# Altium project rookieboard.PrjPcb (part 2 of 2)

## Sheet usb_to_uart_swd_bridge.SchDoc: Bridge, USB to UART, SWD
size B; Organization: Altium Limited; Address1: L3, 12a Rodborough Rd; Address2: Frenchs Forest; Address3: NSW; Address4: Australia 2086; Revision: A; SheetNumber: 6; SheetTotal: 7
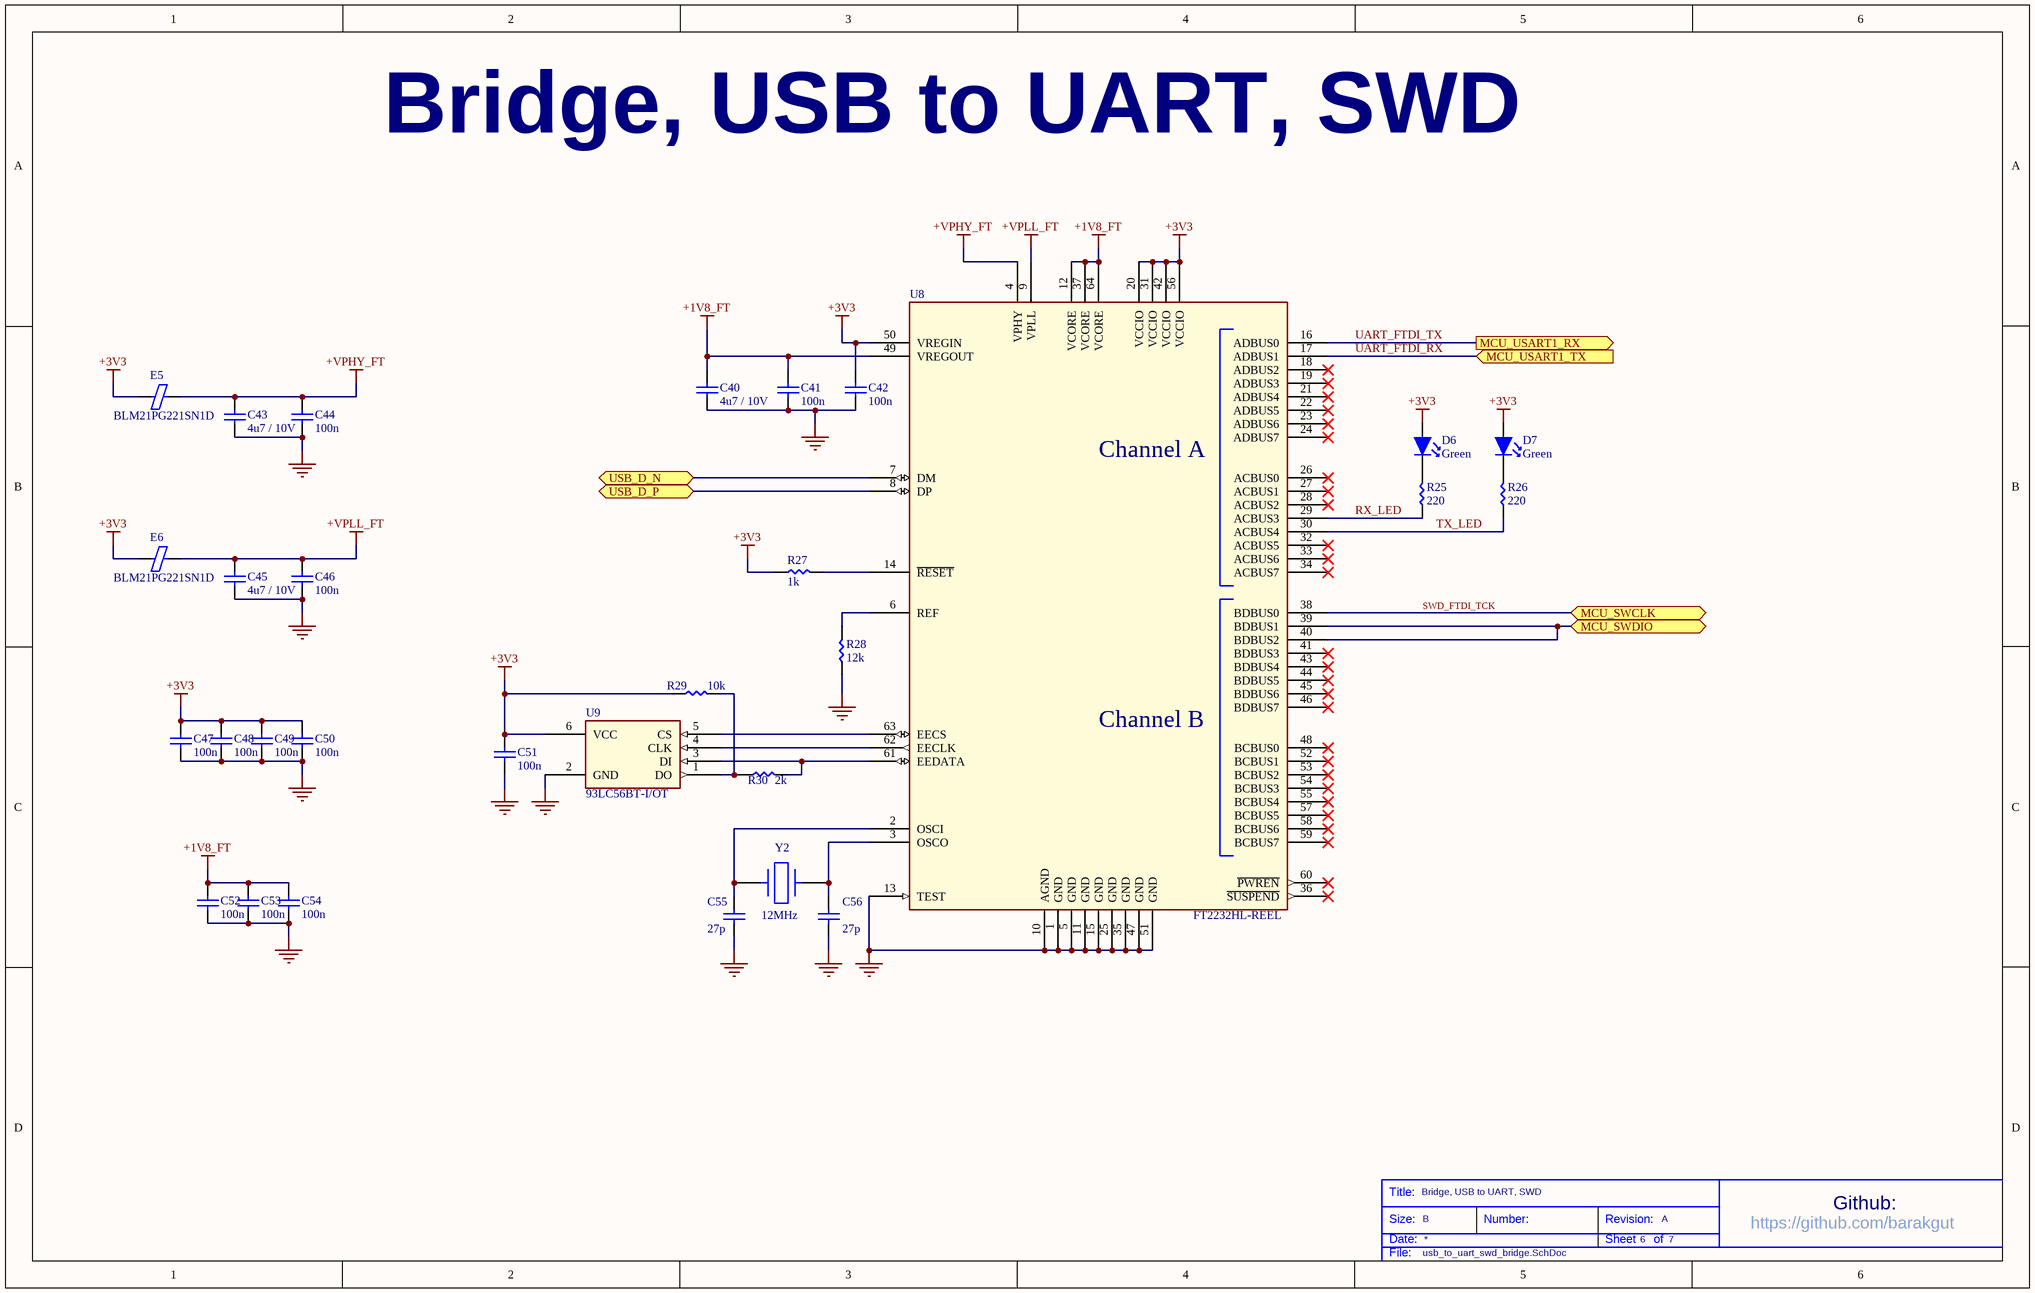
[diagram p5: usb_to_uart_swd_bridge.SchDoc]

### Parts
C40  4u7 / 10V  [C0805]
C41  100n  [C0402]
C42  100n  [C0402]
C43  4u7 / 10V  [C0805]
C44  100n  [C0402]
C45  4u7 / 10V  [C0805]
C46  100n  [C0402]
C47  100n  [C0402]
C48  100n  [C0402]
C49  100n  [C0402]
C50  100n  [C0402]
C51  100n  [C0402]
C52  100n  [C0402]
C53  100n  [C0402]
C54  100n  [C0402]
C55  27p  [C0402]
C56  27p  [C0402]
D6  Green  [150141VS73100_LED]
D7  Green  [150141VS73100_LED]
E5  BLM21PG221SN1D  [R0805]
E6  BLM21PG221SN1D  [R0805]
R25  220  [R0805]
R26  220  [R0805]
R27  1k  [R0805]
R28  12k  [R0805]
R29  10k  [R0805]
R30  2k  [R0805]
U8  FT2232HL-REEL  [LQFP64]
U9  93LC56BT-I/OT  [SOT-23-6]
Y2  12MHz  [ABLS7M2-12.000MHZ-D-2Y-T]

### Ports
MCU_SWCLK (bidir), MCU_SWDIO (bidir), MCU_USART1_RX (out), MCU_USART1_TX (in), USB_D_N (bidir), USB_D_P (bidir)

### Nets
+1V8_FT: C40.2 C41.2 C52.2 C53.2 C54.2 U8.12(VCORE) U8.37(VCORE) U8.49(VREGOUT) U8.64(VCORE)
+3V3: C42.2 C47.2 C48.2 C49.2 C50.2 C51.2 D6.2(A) D7.2(A) E5.1 E6.1 R27.1 R29.1 U8.20(VCCIO) U8.31(VCCIO) U8.42(VCCIO) U8.50(VREGIN) U8.56(VCCIO) U9.6(VCC)
+VPHY_FT: C43.2 C44.2 E5.2 U8.4(VPHY)
+VPLL_FT: C45.2 C46.2 E6.2 U8.9(VPLL)
GND: C40.1 C41.1 C42.1 C43.1 C44.1 C45.1 C46.1 C47.1 C48.1 C49.1 C50.1 C51.1 C52.1 C53.1 C54.1 C55.1 C56.1 R28.1 U8.1(GND) U8.5(GND) U8.10(AGND) U8.11(GND) U8.13(TEST) U8.15(GND) U8.25(GND) U8.35(GND) U8.47(GND) U8.51(GND) U9.2(GND)
RX_LED: R25.1 U8.29(ACBUS3)
SWD_FTDI_TCK: U8.38(BDBUS0) ; port MCU_SWCLK
TX_LED: R26.1 U8.30(ACBUS4)
UART_FTDI_RX: U8.17(ADBUS1) ; port MCU_USART1_TX
UART_FTDI_TX: U8.16(ADBUS0) ; port MCU_USART1_RX
NetC55_2: C55.2 U8.2(OSCI) Y2.2
NetC56_2: C56.2 U8.3(OSCO) Y2.1
NetD6_1: D6.1(K) R25.2
NetD7_1: D7.1(K) R26.2
NetR20_2: U8.7(DM) ; port USB_D_N
NetR21_2: U8.8(DP) ; port USB_D_P
NetR27_2: R27.2 U8.14(~{RESET})
NetR28_2: R28.2 U8.6(REF)
NetR29_2: R29.2 R30.1 U9.1(DO)
NetR30_2: R30.2 U8.61(EEDATA) U9.3(DI)
NetU1_34: U8.39(BDBUS1) U8.40(BDBUS2) ; port MCU_SWDIO
NetU8_62: U8.62(EECLK) U9.4(CLK)
NetU8_63: U8.63(EECS) U9.5(CS)

Not connected (* = marked no-connect by the designer): U8 18(ADBUS2)* 19(ADBUS3)* 21(ADBUS4)* 22(ADBUS5)* 23(ADBUS6)* 24(ADBUS7)* 26(ACBUS0)* 27(ACBUS1)* 28(ACBUS2)* 32(ACBUS5)* 33(ACBUS6)* 34(ACBUS7)* 36(~{SUSPEND})* 41(BDBUS3)* 43(BDBUS4)* 44(BDBUS5)* 45(BDBUS6)* 46(BDBUS7)* 48(BCBUS0)* 52(BCBUS1)* 53(BCBUS2)* 54(BCBUS3)* 55(BCBUS4)* 57(BCBUS5)* 58(BCBUS6)* 59(BCBUS7)* 60(~{PWREN})*

### Notes on the sheet
- Bridge, USB to UART, SWD
- Title:
- Size:
- Date:
- B
- Number:
- Revision:
- Sheet
- of
- https://github.com/barakgut
- Github:
- File:
- (in symbol FT2232HL-REEL) Channel A; Channel B

### Library data of the parts
C40 C43 C45 = C2012X7R1A475K085AC: 4.7µF ±10% 10V X7R Ceramic Capacitor -55°C ~ 125°C Surface Mount, MLCC 0805 (2012 Metric) 0.079" L x 0.049" W (2.00mm x 1.25mm); Manufacturer: TDK; Product Training Modules: C Series General Applications SEAT, CCV, and TVCL Design Tools Guide to Replacing an Electrolytic Capacitor with an MLCC; EDA / CAD Models: Download from Accelerated Designs; Online Catalog: C Series, General Purpose; Other Names: 445-14527-6; Supplier 1: Digi-Key; Supplier Part Number 1: 445-14527-1-ND; Stock 1: 1; Pricing 1: 1=0.28, 10=0.19, 100=0.1075, 500=0.0759, 1000=0.0664 (USD); RoHS Information: RoHS Certificate-MLCC; Standard Package: 1; Category: Capacitors; Family: Ceramic Capacitors; Series: C; Packaging: Digi-Reel®; Capacitance: 4.7µF; Tolerance: ±10%; Voltage - Rated: 10V; Temperature Coefficient: X7R; Mounting Type: Surface Mount, MLCC; Operating Temperature: -55°C ~ 125°C; Applications: General Purpose; Package / Case: 0805 (2012 Metric); Size / Dimension: 0.079" L x 0.049" W (2.00mm x 1.25mm); Thickness (Max): 0.039" (1.00mm); Manufacturer Part Number: C2012X7R1A475K085AC
C41 C42 C44 C46-C54 = CGA2B3X7R1E104K050BB: TDK         CGA2B3X7R1E104K050BB             SMD Multilayer Ceramic Capacitor, 0402 [1005 Metric], 0.1 F, 25 V,  10%, X7R, CGA Series; PCN Part Number: MLCC Part Number Change 30/Nov/2012; Capacitance: 0.1µF; Product Training Modules: CGA Series for Automotive Applications SEAT, CCV, and TVCL Design Tools Guide to Replacing an Electrolytic Capacitor with an MLCC; Featured Product: CGA Series MLCC Capacitors; Voltage - Rated: 25V; Online Catalog: CGA Series, Automotive General, Mid and High Voltage; Other Names: 445-6902-6; Supplier 1: Digi-Key; Supplier Part Number 1: 445-6902-1-ND; Manufacturer: TDK; Stock 1: 100000; Pricing 1: 1=0.16, 10=0.115, 100=0.054, 500=0.0379, 1000=0.0314, 2500=0.0292, 5000=0.0267 (USD); Package / Case: 0402 (1005 Metric); Packaging: Digi-Reel®; RoHS Information: RoHS Certificate-MLCC; Standard Package: 1; Category: Capacitors; Family: Ceramic Capacitors; Series: CGA; Tolerance: ±10%; Temperature Coefficient: X7R; Mounting Type: Surface Mount, MLCC; Operating Temperature: -55°C ~ 125°C; Applications: Automotive; Ratings: AEC-Q200; Size / Dimension: 0.039" L x 0.020" W (1.00mm x 0.50mm); Height - Seated (Max): -; Thickness (Max): 0.022" (0.55mm); Lead Spacing: -; Features: -; Lead Style: -; ComponentLink1URL: http://www.farnell.com/datasheets/1735392.pdf; ComponentLink1Description: http://www.farnell.com/datasheets/1735392.pdf; ComponentLink2URL: http://www.mouser.com/ds/2/400/lcc_automotive_general_en-843974.pdf; ComponentLink2Description: http://www.mouser.com/ds/2/400/lcc_automotive_general_en-843974.pdf; Manufacturer Part Number: CGA2B3X7R1E104K050BB
C55 C56 = GJM1555C1H270FB01D: Manufacturer: Murata; Supplier 1: Digi-Key; Supplier Part Number 1: 490-16380-1-ND; Stock 1: 14501; Pricing 1: 1=0.23, 10=0.155, 100=0.0784, 500=0.0536, 1000=0.0474, 2500=0.0454, 5000=0.0413 (USD); Manufacturer Part Number: GJM1555C1H270FB01D; ComponentLink1URL: http://datasheet.octopart.com/GJM1555C1H270FB01D-Murata-datasheet-8819587.pdf; ComponentLink1Description: http://datasheet.octopart.com/GJM1555C1H270FB01D-Murata-datasheet-8819587.pdf; ComponentLink2URL: http://datasheet.octopart.com/GJM1555C1H270FB01D-Murata-datasheet-10025737.pdf; ComponentLink2Description: http://datasheet.octopart.com/GJM1555C1H270FB01D-Murata-datasheet-10025737.pdf; ComponentLink3URL: http://datasheet.octopart.com/GJM1555C1H270FB01D-Murata-datasheet-11978611.pdf; ComponentLink3Description: http://datasheet.octopart.com/GJM1555C1H270FB01D-Murata-datasheet-11978611.pdf; ComponentLink4URL: http://datasheet.octopart.com/GJM1555C1H270FB01D-Murata-datasheet-12510076.pdf; ComponentLink4Description: http://datasheet.octopart.com/GJM1555C1H270FB01D-Murata-datasheet-12510076.pdf; ComponentLink5URL: http://datasheet.octopart.com/GJM1555C1H270FB01D-Murata-datasheet-12515295.pdf; ComponentLink5Description: http://datasheet.octopart.com/GJM1555C1H270FB01D-Murata-datasheet-12515295.pdf
D6 D7 = 150141VS73100: WURTH ELEKTRONIK   150141VS73100   LED, GREEN, 90MCD, 570NM; Manufacturer: Wurth Electronics; Dynamic Catalog: 3.5mm x 2.8mm Round with Flat Top LEDs; 3D Model: SMTW_3528.igs / SMTW_3528.stp / SMTW_3528.wrl; Wavelength - Peak: 572nm; Voltage - Forward (Vf) (Typ): 2V; Current - Test: 20mA; Viewing Angle: 120°; Lens Type: Clear; Lens Style/Size: Round with Flat Top, 2.4mm; Other Names: 732-5002-1; Supplier 1: Digi-Key; Supplier Part Number 1: 732-5002-1-ND; Stock 1: 7722; Pricing 1: 1=0.17, 100=0.149, 500=0.113 (USD); Standard Package: 1; Category: Optoelectronics; Family: LED Indication - Discrete; Series: WL-SMTW; Packaging: Cut Tape (CT); Color: Green; Wavelength - Dominant: 570nm; Millicandela Rating: 90mcd; Package / Case: 2-PLCC; Size / Dimension: 3.20mm L x 2.80mm W; Height: 2.10mm; Mounting Type: Surface Mount; Online Catalog: 3.5mm x 2.8mm Round with Flat Top LEDs; Manufacturer Part Number: 150141VS73100
E5 E6 = BLM21PG221SN1D: FERRITE CHIP 220 OHM 0805; Manufacturer: Murata; Product Training Modules: Ferrite Beads and Arrays; Catalog Drawings: BLM21 Series Side BLM21 Series Top; EDA / CAD Models: Download from Accelerated Designs; Filter Type: Power Line; Number of Lines: 1; Impedance @ Frequency: 220 Ohm @ 100MHz; Current Rating (Max): 2A; DC Resistance (DCR) (Max): 45 mOhm; Online Catalog: EMIFIL® BLM21P Series; Other Names: 490-1054-6; Supplier 1: Digi-Key; Supplier Part Number 1: 490-1054-1-ND; Stock 1: 1796179; Pricing 1: 1=0.1, 10=0.081, 25=0.0732, 50=0.0538, 100=0.0464, 250=0.0366, 500=0.0309, 1000=0.0261 (USD); Standard Package: 1; Category: Filters; Family: Ferrite Beads and Chips; Series: BLM21P; Packaging: Digi-Reel®; Ratings: -; Operating Temperature: -55°C ~ 125°C; Package / Case: 0805 (2012 Metric); Mounting Type: Surface Mount; Height (Max): 0.041" (1.05mm); Size / Dimension: 0.079" L x 0.049" W (2.00mm x 1.25mm); Manufacturer Part Number: BLM21PG221SN1D
R25 R26 = AC0805FR-07220RL: Thick Film Resistors - SMD 1/8W 220ohm 1%; Manufacturer: Yageo; Case Height: 0.5 mm; Case Length: 2 mm; Case Width: 1.25 mm; Power Rating: 125 mW (1/8 W); Resistance: 220 Ohms; Temperature Coefficient: 100 PPM / C; Voltage Rating: 150 V; Supplier 1: Digi-Key; Supplier Part Number 1: YAG3711CT-ND; Stock 1: 11948; Pricing 1: 1=0.1, 10=0.055, 100=0.0225, 1000=0.0101, 2500=0.0088 (USD); Brand: Yageo; Case Code - in: 0805; Case Code - mm: 2012; Dimensions: 1.25 mm W x 2 mm L x 0.5 mm H; Product Category: Thick Film Resistors - SMD; Operating Temperature Range: - 55 C to + 155 C; Package / Case: 0805 (2012 metric); Packaging: Reel; Product: Thick Film Resistors SMD; Termination Style: SMD/SMT; RoHS: Details; Tolerance: 1 %; Series: AC; Type: Chip Resistor Surface Mount; Manufacturer Part Number: AC0805FR-07220RL
R27 = RC0805FR-071KL: RES SMD 1K OHM 1% 1/8W 0805; Manufacturer: Yageo; Resistance: 1 kOhms; Power Rating: 125 mW (1/8 W); Voltage Rating: 150 V; Temperature Coefficient: 100 PPM / C; Supplier 1: Digi-Key; Supplier Part Number 1: 311-1.00KCRCT-ND; Stock 1: 1262363; Pricing 1: 1=0.1, 10=0.046, 100=0.0186, 1000=0.0084, 2500=0.0073 (USD); Termination Style: SMD/SMT; Product: Thick Film Resistors General Purpose; Tolerance: 1 %; Case Code - in: 0805; Case Code - mm: 2012; Series: RC; Operating Temperature Range: - 55 C to + 155 C; Packaging: Reel; Manufacturer Part Number: RC0805FR-071KL
R28 = AC0805FR-0712KL: Res Thick Film 0805 12K Ohm 1% 0.125W(1/8W) ±100ppm/C Sulfur Resistant Molded SMD Automotive Paper T/R; Manufacturer: Yageo; Resistance: 12kohm; Temperature Coefficient: ±100; Product Length (mm): 2mm; Product Depth (mm): 1.25mm; Product Height (mm): 0.5mm; Supplier 1: Digi-Key; Supplier Part Number 1: YAG3692CT-ND; Stock 1: 218; Pricing 1: 1=0.1, 10=0.055, 100=0.0225, 1000=0.0101, 2500=0.0088 (USD); Type: Thick Film; Power Rating(s): 1/8W; Tolerance (+ or -): 1%; Package / Case: 0805; Packaging: Tape and Reel; Operating Temp Range: -55C to 155C; Case Style: Molded; Military Standard: Not Required; Failure Rate: Not Required; Construction: Rectangular; Termination Style: Not Required; Manufacturer Part Number: AC0805FR-0712KL
R29 = RC0805FR-0710KL: RES SMD 10K OHM 1% 1/8W 0805; Manufacturer: Yageo; Resistance: 10 kOhms; Power Rating: 125 mW (1/8 W); Voltage Rating: 150 V; Temperature Coefficient: 100 PPM / C; Supplier 1: Digi-Key; Supplier Part Number 1: 311-10.0KCRCT-ND; Stock 1: 31531286; Pricing 1: 1=0.1, 10=0.046, 100=0.0186, 1000=0.0084, 2500=0.0073 (USD); Termination Style: SMD/SMT; Product: Thick Film Resistors General Purpose; Tolerance: 1 %; Case Code - in: 0805; Case Code - mm: 2012; Series: RC; Operating Temperature Range: - 55 C to + 155 C; Packaging: Reel; Manufacturer Part Number: RC0805FR-0710KL
R30 = RC0805FR-072KL: RES SMD 2K OHM 1% 1/8W 0805; Manufacturer: Yageo; Resistance: 2 kOhms; Power Rating: 125 mW (1/8 W); Voltage Rating: 150 V; Temperature Coefficient: 100 PPM / C; Supplier 1: Digi-Key; Supplier Part Number 1: 311-2.00KCRCT-ND; Stock 1: 993055; Pricing 1: 1=0.1, 10=0.046, 100=0.0186, 1000=0.0084, 2500=0.0073 (USD); Termination Style: SMD/SMT; Product: Thick Film Resistors General Purpose; Tolerance: 1 %; Case Code - in: 0805; Case Code - mm: 2012; Series: RC; Operating Temperature Range: - 55 C to + 155 C; Packaging: Reel; Manufacturer Part Number: RC0805FR-072KL
U8 = FT2232HL-REEL: IC USB HS DUAL UART/FIFO 64-LQFP; Manufacturer: FTDI; Number of Channels: 2; Interface Circuit Standard 1: RS-232/RS-422/RS-485; Transmitter and Receiver FIFO Counter: No; Data Rate: 480Mbps; Operating Supply Voltage (Typ): 1.8/3.3V; Operating Supply Voltage (Max): 3.63V; Operating Supply Voltage (Min): 1.62V; Supply Current: 70(Typ)mA; Supplier 1: Digi-Key; Supplier Part Number 1: 768-1024-1-ND; Stock 1: 30383; Pricing 1: 1=6.71, 10=6.2, 100=5.4, 250=4.56, 500=4.06 (USD); Package Type: LQFP; Packaging: Tape and Reel; Mounting: Surface Mount; Pin Count: 64; Operating Temperature (Min): -40C; Operating Temperature (Max): 85C; Operating Temperature Classification: Industrial; Manufacturer Part Number: FT2232HL-REEL
U9 = 93LC56BT-I/OT: EEPROM 128x16; Manufacturer: Microchip; Access Time (Max): 250 ns; Data Retention: 200; Density: 2048 Bit; Frequency: 2 MHz; Interface Type: Serial (Microwire); Operating Supply Voltage (Max): 5.5 V; Operating Supply Voltage (Min): 2.5 V; Operating Supply Voltage (Typ): 3.3/5 V; Programmable: Yes; Rad Hardened: No; Supply Current: 2 mA; Supplier 1: Digi-Key; Supplier Part Number 1: 93LC56BT-I/OTCT-ND; Stock 1: 24330; Pricing 1: 1=0.23, 25=0.2164, 100=0.2119 (USD); Mounting: Surface Mount; Operating Temp Range: -40C to 85C; Operating Temperature (Max): 85C; Operating Temperature (Min): -40C; Operating Temperature Classification: Industrial; Organization: 128x16; Package Type: SOT-23; Packaging: Tape and Reel; Pin Count: 6; Write Protection: No; Manufacturer Part Number: 93LC56BT-I/OT
Y2 = ABLS7M2-12.000MHZ-D-2Y-T: Crystals 12.0MHz 18pF 30ppm -40C +85C; Manufacturer: Abracon; Frequency Tolerance: ±20ppm; ESR (Equivalent Series Resistance): 60 Ohm; Operating Mode: Fundamental; Supplier 1: Digi-Key; Supplier Part Number 1: 535-12824-1-ND; Stock 1: 6192; Pricing 1: 1=0.4, 10=0.33, 50=0.297, 100=0.264, 500=0.2508, 1000=0.2112 (USD); Category: Crystals and Oscillators; Family: Crystals; Series: ABLS7M2; Packaging: Tape & Reel (TR); Type: MHz Crystal; Frequency: 12MHz; Frequency Stability: ±30ppm; Load Capacitance: 18pF; Operating Temperature: -40°C ~ 85°C; Ratings: -; Mounting Type: Surface Mount; Package / Case: 2-SMD, Flat Lead; Size / Dimension: 0.276" L x 0.161" W (7.00mm x 4.10mm); Height: 0.079" (2.00mm); Manufacturer Part Number: ABLS7M2-12.000MHZ-D-2Y-T

## Sheet power.SchDoc: Power
size A4; Organization: Altium Limited; Address1: L3, 12a Rodborough Rd; Address2: Frenchs Forest; Address3: NSW; Address4: Australia 2086; Revision: A; SheetNumber: 7; SheetTotal: 7
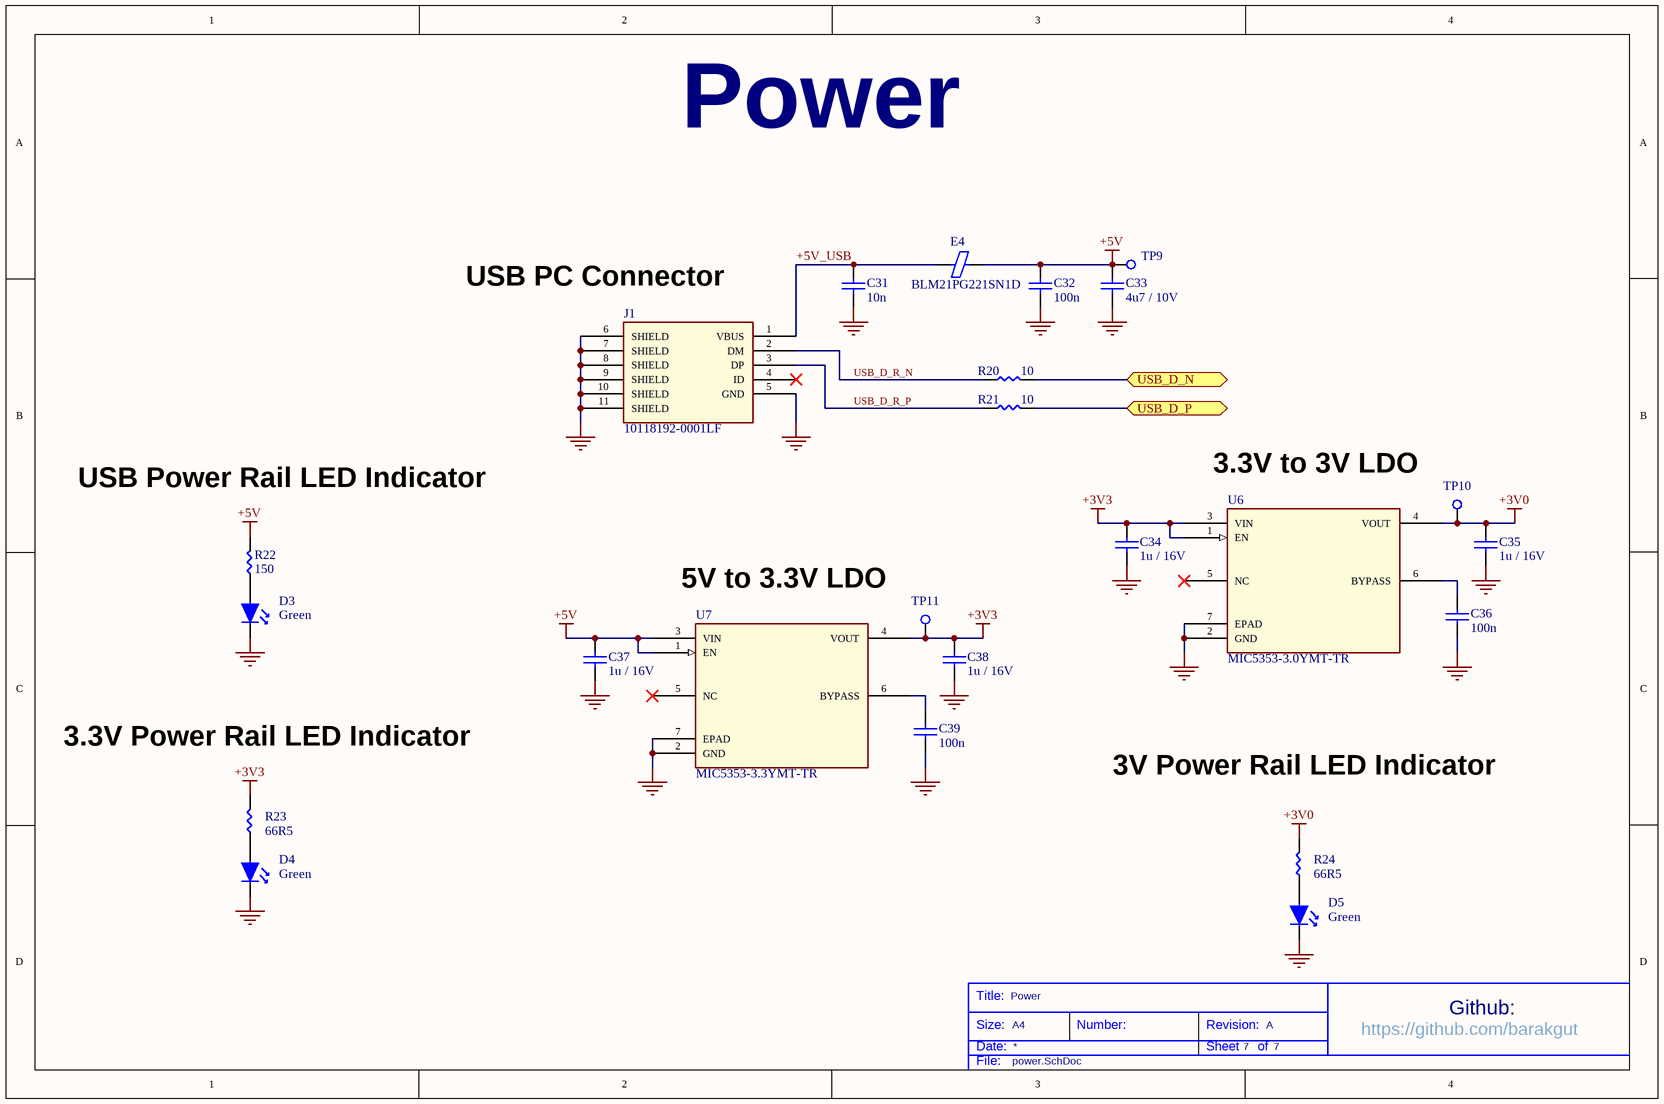
[diagram p6: power.SchDoc]

### Parts
C31  10n  [C0402]
C32  100n  [C0402]
C33  4u7 / 10V  [C0805]
C34  1u / 16V  [C0805]
C35  1u / 16V  [C0805]
C36  100n  [C0402]
C37  1u / 16V  [C0805]
C38  1u / 16V  [C0805]
C39  100n  [C0402]
D3  Green  [150141VS73100_LED]
D4  Green  [150141VS73100_LED]
D5  Green  [150141VS73100_LED]
E4  BLM21PG221SN1D  [R0805]
J1  10118192-0001LF  [10118192-0001LF]
R20  10  [R0402]
R21  10  [R0402]
R22  150  [R0805]
R23  66R5  [R0805]
R24  66R5  [R0805]
TP9  Test Pad 1mm  [TP_1MM]  (value not drawn)  (no BOM)
TP10  Test Pad 1mm  [TP_1MM]  (value not drawn)  (no BOM)
TP11  Test Pad 1mm  [TP_1MM]  (value not drawn)  (no BOM)
U6  MIC5353-3.0YMT-TR  [6-MLF]
U7  MIC5353-3.3YMT-TR  [6-MLF]

### Ports
USB_D_N (bidir), USB_D_P (bidir)

### Nets
+3V0: C35.2 R24.2 TP10.1 U6.4(VOUT)
+3V3: C34.2 C38.2 R23.2 TP11.1 U6.1(EN) U6.3(VIN) U7.4(VOUT)
+5V: C32.2 C33.2 C37.2 E4.2 R22.2 TP9.1 U7.1(EN) U7.3(VIN)
GND: C31.1 C32.1 C33.1 C34.1 C35.1 C36.1 C37.1 C38.1 C39.1 D3.1(K) D4.1(K) D5.1(K) J1.5(GND) J1.6(SHIELD) J1.7(SHIELD) J1.8(SHIELD) J1.9(SHIELD) J1.10(SHIELD) J1.11(SHIELD) U6.2(GND) U6.7(EPAD) U7.2(GND) U7.7(EPAD)
+5V_USB: C31.2 E4.1 J1.1(VBUS)
USB_D_R_N: J1.2(DM) R20.1
USB_D_R_P: J1.3(DP) R21.1
NetC36_2: C36.2 U6.6(BYPASS)
NetC39_2: C39.2 U7.6(BYPASS)
NetD3_2: D3.2(A) R22.1
NetD4_2: D4.2(A) R23.1
NetD5_2: D5.2(A) R24.1
NetR20_2: R20.2 ; port USB_D_N
NetR21_2: R21.2 ; port USB_D_P

Not connected (* = marked no-connect by the designer): J1 4(ID)*; U6 5(NC)*; U7 5(NC)*

### Notes on the sheet
- Power
- (near J1) USB PC Connector
- 3.3V to 3V LDO
- (near R22) USB Power Rail LED Indicator
- 5V to 3.3V LDO
- (near R23) 3.3V Power Rail LED Indicator
- 3V Power Rail LED Indicator
- Title:
- Size:
- Date:
- A4
- Number:
- Revision:
- Sheet
- of
- https://github.com/barakgut
- Github:
- File:

### Library data of the parts
C31 = CGA2B3X7R1V103K050BB: TDK         CGA2B3X7R1V103K050BB             SMD Multilayer Ceramic Capacitor, 0402 [1005 Metric], 0.01 F, 35 V,  10%, X7R, CGA Series; PCN Part Number: MLCC Part Number Change 30/Nov/2012; Product Training Modules: CGA Series for Automotive Applications SEAT, CCV, and TVCL Design Tools Guide to Replacing an Electrolytic Capacitor with an MLCC; Featured Product: CGA Series MLCC Capacitors; Capacitance: 10000pF; Voltage - Rated: 35V; Online Catalog: CGA Series, Automotive General, Mid and High Voltage; Other Names: 445-6900-6; Supplier 1: Digi-Key; Supplier Part Number 1: 445-6900-1-ND; Manufacturer: TDK; Stock 1: 100000; Pricing 1: 1=0.11, 10=0.083, 100=0.0372, 500=0.0265, 1000=0.0209, 2500=0.019, 5000=0.0174 (USD); Tolerance: ±10%; Operating Temperature: -55°C ~ 125°C; Category: Capacitors; RoHS Information: RoHS Certificate-MLCC; Standard Package: 1; Family: Ceramic Capacitors; Series: CGA; Packaging: Digi-Reel®; Temperature Coefficient: X7R; Mounting Type: Surface Mount, MLCC; Applications: Automotive; Ratings: AEC-Q200; Package / Case: 0402 (1005 Metric); Size / Dimension: 0.039" L x 0.020" W (1.00mm x 0.50mm); Height - Seated (Max): -; Thickness (Max): 0.022" (0.55mm); Lead Spacing: -; Features: -; Lead Style: -; ComponentLink1URL: http://www.farnell.com/datasheets/1807242.pdf; ComponentLink1Description: http://www.farnell.com/datasheets/1807242.pdf; ComponentLink2URL: http://www.mouser.com/ds/2/400/lcc_automotive_general_en-843974.pdf; ComponentLink2Description: http://www.mouser.com/ds/2/400/lcc_automotive_general_en-843974.pdf; Manufacturer Part Number: CGA2B3X7R1V103K050BB
C32 C36 C39 = CGA2B3X7R1E104K050BB: as C41 on sheet usb_to_uart_swd_bridge; Supplier 1: Digi-Key; Supplier Part Number 1: 445-6902-1-ND; Manufacturer: TDK; Stock 1: 100000; Pricing 1: 1=0.16, 10=0.115, 100=0.054, 500=0.0379, 1000=0.0314, 2500=0.0292, 5000=0.0267 (USD); Package / Case: 0402 (1005 Metric); Packaging: Digi-Reel®; RoHS Information: RoHS Certificate-MLCC; Standard Package: 1; Category: Capacitors; Family: Ceramic Capacitors; Series: CGA; Tolerance: ±10%; Temperature Coefficient: X7R; Mounting Type: Surface Mount, MLCC; Operating Temperature: -55°C ~ 125°C; Applications: Automotive; Ratings: AEC-Q200; Size / Dimension: 0.039" L x 0.020" W (1.00mm x 0.50mm); Height - Seated (Max): -; Thickness (Max): 0.022" (0.55mm); Lead Spacing: -; Features: -; Lead Style: -; ComponentLink1URL: http://www.farnell.com/datasheets/1735392.pdf; ComponentLink1Description: http://www.farnell.com/datasheets/1735392.pdf; ComponentLink2URL: http://www.mouser.com/ds/2/400/lcc_automotive_general_en-843974.pdf; ComponentLink2Description: http://www.mouser.com/ds/2/400/lcc_automotive_general_en-843974.pdf; Manufacturer Part Number: CGA2B3X7R1E104K050BB
C33 = C2012X7R1A475K085AC: as C40 on sheet usb_to_uart_swd_bridge; Supplier 1: Digi-Key; Supplier Part Number 1: 445-14527-1-ND; Stock 1: 1; Pricing 1: 1=0.28, 10=0.19, 100=0.1075, 500=0.0759, 1000=0.0664 (USD); RoHS Information: RoHS Certificate-MLCC; Standard Package: 1; Category: Capacitors; Family: Ceramic Capacitors; Series: C; Packaging: Digi-Reel®; Capacitance: 4.7µF; Tolerance: ±10%; Voltage - Rated: 10V; Temperature Coefficient: X7R; Mounting Type: Surface Mount, MLCC; Operating Temperature: -55°C ~ 125°C; Applications: General Purpose; Package / Case: 0805 (2012 Metric); Size / Dimension: 0.079" L x 0.049" W (2.00mm x 1.25mm); Thickness (Max): 0.039" (1.00mm); Manufacturer Part Number: C2012X7R1A475K085AC
C34 C35 C37 C38 = C0805C105K4RAC7800: Multilayer Ceramic Capacitors MLCC - SMD/SMT 16volts 1uF X7R 10%; Manufacturer: KEMET; Rad Hard: No; Voltage: 16 Vdc; Product Length: 2 mm; Product Height: 0.9 mm; Product Depth: 1.25 mm; Supplier 1: Digi-Key; Supplier Part Number 1: 399-1284-1-ND; Stock 1: 40000; Pricing 1: 1=0.17, 10=0.124, 100=0.0581, 500=0.0408, 1000=0.0337 (USD); Package/Case: 0805; Mounting: Surface Mount; Capacitance Value: 1 uF; Tolerance: 10 %; Dielectric: X7R; Operating Temperature: -55 to 125 °C; Construction: Flat; Category: Capacitor Ceramic Multilayer; Manufacturer Part Number: C0805C105K4RAC7800
D3-D5 = 150141VS73100: as D6 on sheet usb_to_uart_swd_bridge; Supplier 1: Digi-Key; Supplier Part Number 1: 732-5002-1-ND; Stock 1: 7722; Pricing 1: 1=0.17, 100=0.149, 500=0.113 (USD); Standard Package: 1; Category: Optoelectronics; Family: LED Indication - Discrete; Series: WL-SMTW; Packaging: Cut Tape (CT); Color: Green; Wavelength - Dominant: 570nm; Millicandela Rating: 90mcd; Package / Case: 2-PLCC; Size / Dimension: 3.20mm L x 2.80mm W; Height: 2.10mm; Mounting Type: Surface Mount; Online Catalog: 3.5mm x 2.8mm Round with Flat Top LEDs; Manufacturer Part Number: 150141VS73100
E4 = BLM21PG221SN1D: as E5 on sheet usb_to_uart_swd_bridge; Supplier 1: Digi-Key; Supplier Part Number 1: 490-1054-1-ND; Stock 1: 1796179; Pricing 1: 1=0.1, 10=0.081, 25=0.0732, 50=0.0538, 100=0.0464, 250=0.0366, 500=0.0309, 1000=0.0261 (USD); Standard Package: 1; Category: Filters; Family: Ferrite Beads and Chips; Series: BLM21P; Packaging: Digi-Reel®; Ratings: -; Operating Temperature: -55°C ~ 125°C; Package / Case: 0805 (2012 Metric); Mounting Type: Surface Mount; Height (Max): 0.041" (1.05mm); Size / Dimension: 0.079" L x 0.049" W (2.00mm x 1.25mm); Manufacturer Part Number: BLM21PG221SN1D
J1 = 10118192-0001LF: USB - micro B USB 2.0 Receptacle Connector 5 Position Surface Mount, Right Angle, Horizontal; Manufacturer: Amphenol FCI; Number of Contacts: 5 Contact; Gender: Female; Current Rating: 1.8 A; Brand: FCI; Connector Type: Micro USB Type B receptacle; Insulation Resistance: 1000 MOhms; Supplier 1: Digi-Key; Supplier Part Number 1: 609-4613-1-ND; Stock 1: 158518; Pricing 1: 1=0.42, 10=0.393, 25=0.3536, 50=0.3144, 100=0.3013, 250=0.2751, 500=0.262 (USD); Product Category: USB Connectors; RoHS: Details; Product: Micro USB Type B Connectors; Standard: USB 2.0; Termination Style: SMD/SMT; Color: Black; Contact Material: Copper Alloy; Contact Plating: Gold; Flammability Rating: UL 94 V-0; Mounting Angle: Right; Operating Temperature Range: - 55 C to + 85 C; Packaging: Reel; Factory Pack Quantity: 1400; Manufacturer Part Number: 10118192-0001LF
R20 R21 = RC0402FR-0710RL: RES SMD 10 OHM 1% 1/16W 0402; Manufacturer: Yageo; Resistance: 10 Ohms; Power Rating: 62.5 mW (1/16 W); Temperature Coefficient: 100 PPM / C; Voltage Rating: 50 V; Supplier 1: Digi-Key; Supplier Part Number 1: 311-10.0LRCT-ND; Stock 1: 1306139; Pricing 1: 1=0.1, 10=0.027, 100=0.0111, 1000=0.005, 2500=0.0043, 5000=0.0036 (USD); Case Code - in: 0402; Case Code - mm: 1005; Operating Temperature Range: - 55 C to + 155 C; Packaging: Reel; Product: Thick Film Resistors General Purpose; Series: RC; Termination Style: SMD/SMT; Tolerance: 1 %; Manufacturer Part Number: RC0402FR-0710RL; ComponentLink1URL: http://www.farnell.com/datasheets/1018594.pdf; ComponentLink1Description: http://www.farnell.com/datasheets/1018594.pdf; ComponentLink2URL: https://www.verical.com/server-webapp/html/getDatasheet?partID=323697; ComponentLink2Description: https://www.verical.com/server-webapp/html/getDatasheet?partID=323697
R22 = AC0805FR-07150RL: Thick Film Resistors - SMD 1/8W 150ohm 1%; Manufacturer: Yageo; Case Height: 0.5 mm; Case Length: 2 mm; Case Width: 1.25 mm; Power Rating: 125 mW (1/8 W); Resistance: 150 Ohms; Temperature Coefficient: 100 PPM / C; Voltage Rating: 150 V; Supplier 1: Digi-Key; Supplier Part Number 1: YAG3694CT-ND; Stock 1: 32315; Pricing 1: 1=0.1, 10=0.055, 100=0.0225, 1000=0.0101, 2500=0.0088 (USD); Brand: Yageo; Case Code - in: 0805; Case Code - mm: 2012; Dimensions: 1.25 mm W x 2 mm L x 0.5 mm H; Product Category: Thick Film Resistors - SMD; Operating Temperature Range: - 55 C to + 155 C; Package / Case: 0805 (2012 metric); Packaging: Reel; Product: Thick Film Resistors SMD; Termination Style: SMD/SMT; RoHS: Details; Tolerance: 1 %; Series: AC; Type: Chip Resistor Surface Mount; Manufacturer Part Number: AC0805FR-07150RL
R23 R24 = RC0805FR-0766R5L: Thick Film Resistors - SMD 66.5 OHM 1%; Manufacturer: Yageo; Case Height: 0.5 mm; Case Length: 2 mm; Case Width: 1.25 mm; Power Rating: 125 mW (1/8 W); Resistance: 66.5 Ohms; Temperature Coefficient: 100 PPM / C; Voltage Rating: 150 V; Supplier 1: Digi-Key; Supplier Part Number 1: 311-66.5CRCT-ND; Stock 1: 162629; Pricing 1: 1=0.1, 10=0.056, 100=0.0228, 1000=0.0102, 2500=0.0089 (USD); Brand: Yageo; Case Code - in: 0805; Case Code - mm: 2012; Dimensions: 1.25 mm W x 2 mm L x 0.5 mm H; Product Category: Thick Film Resistors - SMD; Operating Temperature Range: - 55 C to + 155 C; Package / Case: 0805 (2012 metric); Packaging: Reel; Product: Thick Film Resistors General Purpose; Termination Style: SMD/SMT; RoHS: Details; Tolerance: 1 %; Series: RC; Type: General Purpose Chip Resistor Surface Mount; Manufacturer Part Number: RC0805FR-0766R5L
TP9-TP11 = TEST_PAD_1mm
U6 = MIC5353-3.0YMT-TR: 6Vin, Single 500mA ULDO, 6 UDFN 1.6x1.6x0.6mm T/R; Manufacturer: Microchip; Regulator Topology: Positive Fixed; Voltage - Output: 3V; Voltage - Dropout (Typical): 0.16V @ 500mA; Number of Regulators: 1; Voltage - Input: Up to 6V; Current - Limit (Min): 600mA; Supplier 1: Digi-Key; Supplier Part Number 1: 576-3679-1-ND; Stock 1: 4083; Pricing 1: 1=0.35, 25=0.2884, 100=0.2678 (USD); Category: Integrated Circuits (ICs); Family: PMIC - Voltage Regulators - Linear; Series: -; Packaging: Digi-Reel®; Current - Output: 500mA; Operating Temperature: -40°C ~ 125°C; Mounting Type: Surface Mount; Package / Case: 6-UFDFN Exposed Pad, 6-TMLF®; Supplier Device Package: 6-TMLF® (1.6x1.6); Manufacturer Part Number: MIC5353-3.0YMT-TR
U7 = MIC5353-3.3YMT-TR: MICROCHIP         MIC5353-3.3YMT-TR             Fixed LDO Voltage Regulator, 2.6V to 6V, 160mV Dropout, 3.3Vout, 500mAout, MLF-6; Fixed Output Voltage Nom.: 3.3V; Output Current: 500mA; LDO Regulator Case Style: MLF; No. of Pins: 6Pins; Product Range: 3.3V 500mA LDO Voltage Regulators; SVHC: No SVHC (17-Dec-2015); Supplier 1: Digi-Key; Supplier Part Number 1: 576-3680-1-ND; Manufacturer: Microchip; Stock 1: 12369; Pricing 1: 1=0.43, 25=0.35, 100=0.325 (USD); Output Type: Fixed; Input Voltage Min: 2.6V; Input Voltage Max: 6V; Adjustable Output Voltage Min: -; Adjustable Output Voltage Max: -; Dropout Voltage Vdo: 160mV; Operating Temperature Min: -40°C; Operating Temperature Max: 125°C; Packaging: Cut Tape; Automotive Qualification Standard: -; MSL: MSL 1 - Unlimited; Manufacturer Part Number: MIC5353-3.3YMT-TR

## Nets that join several sheets
+3V0: peripherals (8 pins), power (C35.2 R24.2 TP10.1 U6.4)
+3V3: mcu (5 pins), peripherals (12 pins), usb_to_uart_swd_bridge (18 pins), power (7 pins)
GND: mcu (19 pins), peripherals (48 pins), usb_to_uart_swd_bridge (29 pins), power (23 pins)
NetC26_2: mcu (U1.41), peripherals (C26.2 R5.2)
NetC27_2: mcu (U1.46), peripherals (C27.2 R8.2)
NetC28_2: mcu (U1.43), peripherals (C28.2 R10.2)
NetC29_2: mcu (U1.42), peripherals (C29.2 R11.2)
NetC30_2: mcu (U1.45), peripherals (C30.2 R17.2)
NetQ1_1: mcu (U1.21), peripherals (Q1.1 R7.2)
NetQ2_1: mcu (U1.39), peripherals (Q2.1 R12.2)
NetQ3_1: mcu (U1.18), peripherals (Q3.1 R16.2)
NetQ4_1: mcu (U1.40), peripherals (Q4.1 R18.2)
NetQ5_1: mcu (U1.19), peripherals (Q5.1 R19.2)
NetR2_1: mcu (U1.22), peripherals (R2.1 U2.3)
NetR20_2: usb_to_uart_swd_bridge (U8.7), power (R20.2)
NetR21_2: usb_to_uart_swd_bridge (U8.8), power (R21.2)
NetR31_2: mcu (R31.2), peripherals (U3.2)
NetU1_25: mcu (U1.25), peripherals (U5.2)
NetU1_27: mcu (U1.27), peripherals (U5.3)
NetU1_28: mcu (U1.28), peripherals (U3.3)
NetU1_34: mcu (U1.34), usb_to_uart_swd_bridge (U8.39 U8.40)
SWD_FTDI_TCK: mcu (R32.1), usb_to_uart_swd_bridge (U8.38)
UART_FTDI_RX: mcu (U1.30), usb_to_uart_swd_bridge (U8.17)
UART_FTDI_TX: mcu (U1.31), usb_to_uart_swd_bridge (U8.16)